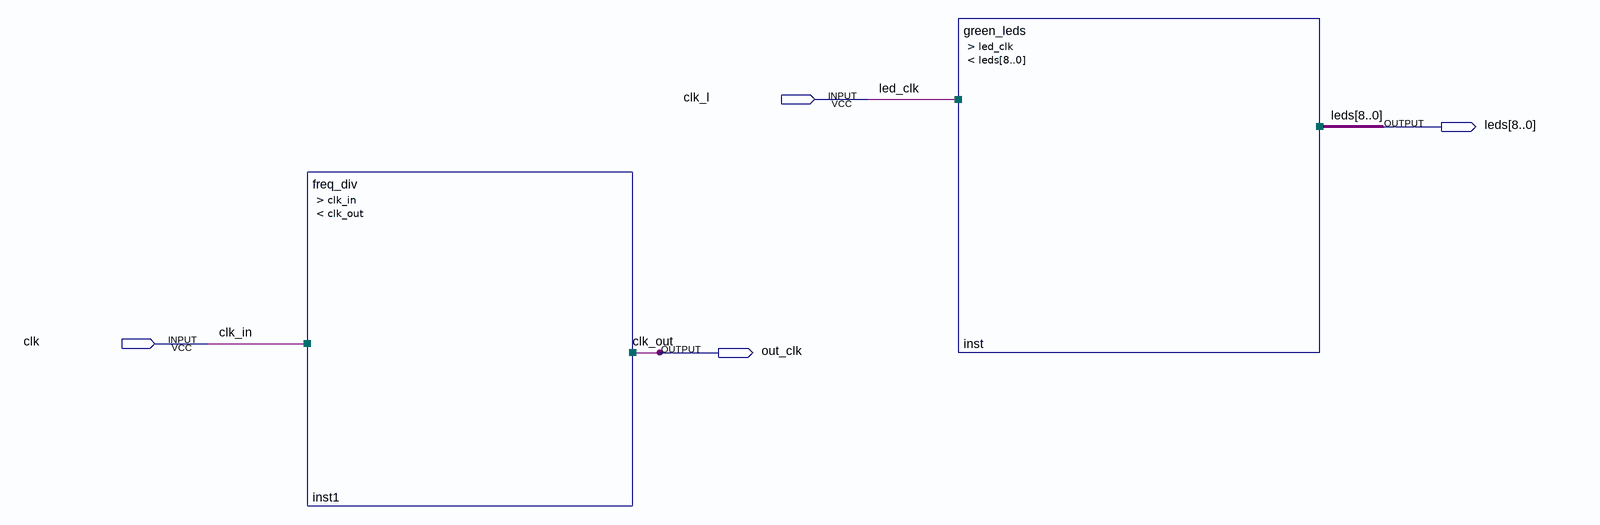
[diagram p0: schematic sheet]
// Quartus schematic ledy.bdf as structural Verilog: 2 symbols, 4 pins
module ledy (
  input  clk_l,
  input  clk,
  output [8:0] leds,
  output out_clk
);

  freq_div inst1 (.clk_in(clk), .clk_out(out_clk));
  green_leds inst (.led_clk(clk_l), .leds(leds));

  // Other names for the same wires on the sheet: clk_in = clk; clk_out = out_clk; led_clk = clk_l
endmodule
